# EAGLE design bucket (EAGLE 7.2.0)
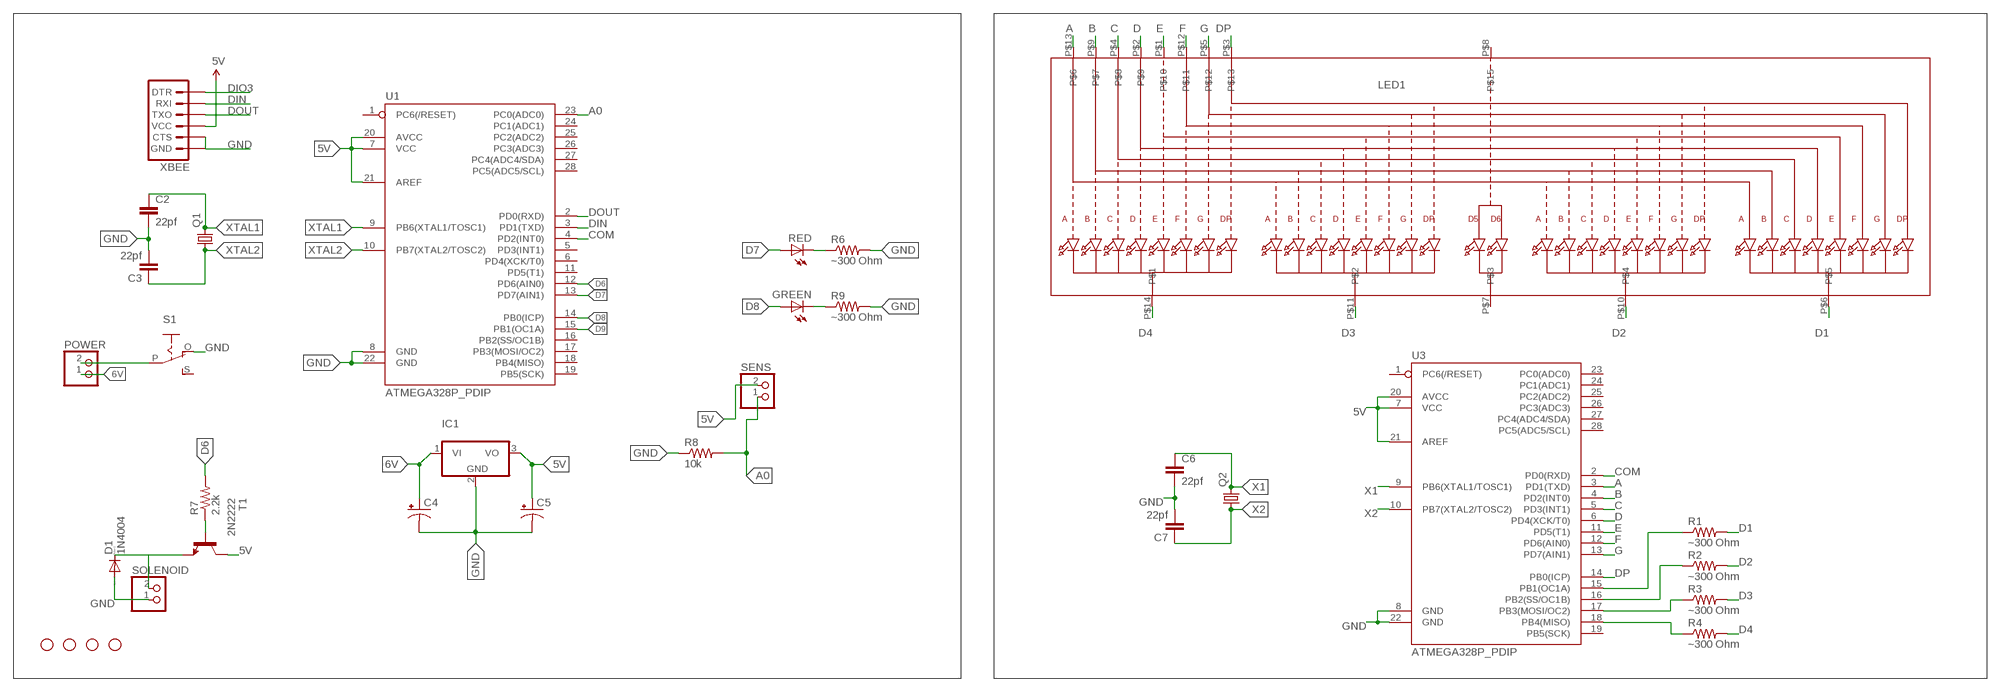
[diagram p0: schematic, sheet 1]

## Parts
C2  22pf  CAP1206  [1206]
C3  22pf  CAP1206  [1206]
C4  CAP_POL1206  [EIA3216]
C5  CAP_POL1206  [EIA3216]
C6  22pf  CAP1206  [1206]
C7  22pf  CAP1206  [1206]
D1  1N4004  [DO41-10]
GREEN  HSMC-C265  [HSMC-C265]
IC1  7805T  [TO220H]
LED1  DISP_SEGMENT_4DIGIT_BL-Q56C43  [SEGMENT-BL-Q56C43]
POWER  JST_2PIN-THM-RA  [JST-PH-2-THM-RA]
Q1  CRYSTALHC49S  [HC49/S]
Q2  CRYSTALHC49S  [HC49/S]
R1  ~300 Ohm  RESISTOR1206  [1206]
R2  ~300 Ohm  RESISTOR1206  [1206]
R3  ~300 Ohm  RESISTOR1206  [1206]
R4  ~300 Ohm  RESISTOR1206  [1206]
R6  ~300 Ohm  RESISTOR1206  [1206]
R7  2.2k  RESISTOR1206  [1206]
R8  10k  RESISTOR1206  [1206]
R9  ~300 Ohm  RESISTOR1206  [1206]
RED  HSMC-C265  [HSMC-C265]
S1  EG1218S  [EG1218]
SENS  JST_2PIN-THM-RA  [JST-PH-2-THM-RA]
SOLENOID  JST_2PIN-THM-RA  [JST-PH-2-THM-RA]
STANDOFF1  STAND-OFF  [STAND-OFF]
STANDOFF2  STAND-OFF  [STAND-OFF]
STANDOFF3  STAND-OFF  [STAND-OFF]
STANDOFF4  STAND-OFF  [STAND-OFF]
T1  2N2222  [TO92-EBC-OVAL]
U1  ATMEGA328P_PDIP  [DIL28-3]
U3  ATMEGA328P_PDIP  [DIL28-3]
XBEE  ARDUINO_SERIAL_PROGRAMPTH  [1X06]

## Nets
1: R1.1 U3.15(PB1(OC1A))
2: R2.1 U3.16(PB2(SS/OC1B))
3: R3.1 U3.17(PB3(MOSI/OC2))
4: R4.1 U3.18(PB4(MISO))
5V: C5.A(+) IC1.3(VO) SENS.2 T1.E(C) U1.7(VCC) U1.20(AVCC) U1.21(AREF) U3.7(VCC) U3.20(AVCC) U3.21(AREF) XBEE.4(VCC)
6V: C4.A(+) IC1.1(VI) POWER.1
A: LED1.P$13 U3.3(PD1(TXD))
A0: R8.2 SENS.1 U1.23(PC0(ADC0))
B: LED1.P$9 U3.4(PD2(INT0))
C: LED1.P$4 U3.5(PD3(INT1))
COM: U1.4(PD2(INT0)) U3.2(PD0(RXD))
D: LED1.P$2 U3.6(PD4(XCK/T0))
D1: LED1.P$6 R1.2
D2: LED1.P$10 R2.2
D3: LED1.P$11 R3.2
D4: LED1.P$14 R4.2
D6: R7.2 U1.12(PD6(AIN0))
D7: RED.A U1.13(PD7(AIN1))
D8: GREEN.A U1.14(PB0(ICP))
D9: U1.15(PB1(OC1A))
DIN: U1.3(PD1(TXD)) XBEE.2(RXI)
DIO3: XBEE.1(DTR)
DOUT: U1.2(PD0(RXD)) XBEE.3(TXO)
DP: LED1.P$3 U3.14(PB0(ICP))
E: LED1.P$1 U3.11(PD5(T1))
F: LED1.P$12 U3.12(PD6(AIN0))
G: LED1.P$5 U3.13(PD7(AIN1))
GND: C2.2 C3.2 C4.C(-) C5.C(-) C6.2 C7.2 D1.A IC1.2(GND) R6.2 R8.1 R9.2 S1.O SOLENOID.1 U1.8(GND) U1.22(GND) U3.8(GND) U3.22(GND) XBEE.5(CTS) XBEE.6(GND)
N$1: POWER.2 S1.P
N$2: D1.C SOLENOID.2 T1.C(E)
N$8: R6.1 RED.C
N$9: R7.1 T1.B
N$15: GREEN.C R9.1
X1: C6.1 Q2.2 U3.9(PB6(XTAL1/TOSC1))
X2: C7.1 Q2.1 U3.10(PB7(XTAL2/TOSC2))
XTAL1: C2.1 Q1.2 U1.9(PB6(XTAL1/TOSC1))
XTAL2: C3.1 Q1.1 U1.10(PB7(XTAL2/TOSC2))
Unconnected: LED1.P$7 LED1.P$8 S1.S U1.1(PC6(/RESET)) U1.5(PD3(INT1)) U1.6(PD4(XCK/T0)) U1.11(PD5(T1)) U1.16(PB2(SS/OC1B)) U1.17(PB3(MOSI/OC2)) U1.18(PB4(MISO)) U1.19(PB5(SCK)) U1.24(PC1(ADC1)) U1.25(PC2(ADC2)) U1.26(PC3(ADC3)) U1.27(PC4(ADC4/SDA)) U1.28(PC5(ADC5/SCL)) U3.1(PC6(/RESET)) U3.19(PB5(SCK)) U3.23(PC0(ADC0)) U3.24(PC1(ADC1)) U3.25(PC2(ADC2)) U3.26(PC3(ADC3)) U3.27(PC4(ADC4/SDA)) U3.28(PC5(ADC5/SCL))

## Library data of the parts
C2 C3 C6 C7 = SparkFun-Passives:CAP: Capacitor Standard 0603 ceramic capacitor, and 0.1" leaded capacitor.
C4 C5 = SparkFun-Passives:CAP_POL: Capacitor Polarized These are standard SMD and PTH capacitors. Normally 10uF, 47uF, and 100uF in electrolytic and tantalum varieties. Always verify the external diameter of the through hole cap, it varies with capacity, voltage, and manufacturer. The EIA devices should be standard.
D1 = diode:1N4004: DIODE general purpose rectifier, 1 A
GREEN RED = SparkFun-Retired:HSMC-C265: RETIRED Avago HSMC-C265 reverse-mounted red LED This is a SMD LED that is mounted to one side of a PCB and shines through a hole to the other side of the PCB. Useful for making boards with no components on one side for mounting and having LED indicator lights shine through the board, panel, etc.
IC1 = adafruit:78*: Positive VOLTAGE REGULATOR Added bigger pads to the TO-92 package
LED1 = microbuilder:DISP_SEGMENT_4DIGIT_BL-Q56C43
POWER SENS SOLENOID = adafruit:JST_2PIN: JST 2-Pin Connectors of various flavors SMT-RA (S2B-PH-SM4) 4UConnector #17311 SMT (B2B-PH-SM4) THM-RA (S2B-PH) THM (B2B-PH)
Q1 Q2 = adafruit:CRYSTAL: CRYSTAL; OC_FARNELL: 1667008; OC_NEWARK: unknown
R1-R4 R6-R9 = SparkFun-Passives:RESISTOR: Resistor Basic schematic elements and footprints for 0603, 1206, and PTH resistors.
S1 = adafruit:EG1218: SLIDING SWITCH 0.1" spacing through hole, vertical SPDT slide switch http://www.ladyada.net/library/pcb/eaglelibrary.html
STANDOFF1-STANDOFF4 = SparkFun-Electromechanical:STAND-OFF: #4 Stand Off This is the mechanical footprint for a #4 phillips button head screw. Use the keepout ring to avoid running the screw head into surrounding components. SKU : PRT-00447
T1 = adafruit:2N2222: NPN TRANSISTOR Big oval pads
U1 U3 = SparkFun-DigitalIC:ATMEGA328P_PDIP: uC used in the Arduino 32kb flash, 1k EEPROM, 2k SRAM This is the through-hole version of this chip.
XBEE = SparkFun:ARDUINO_SERIAL_PROGRAM

## Net classes
0 default: width 0.203 mm
2 gnd: width 0.305 mm, drill 0.711 mm, clearance 0.203 mm

## Board
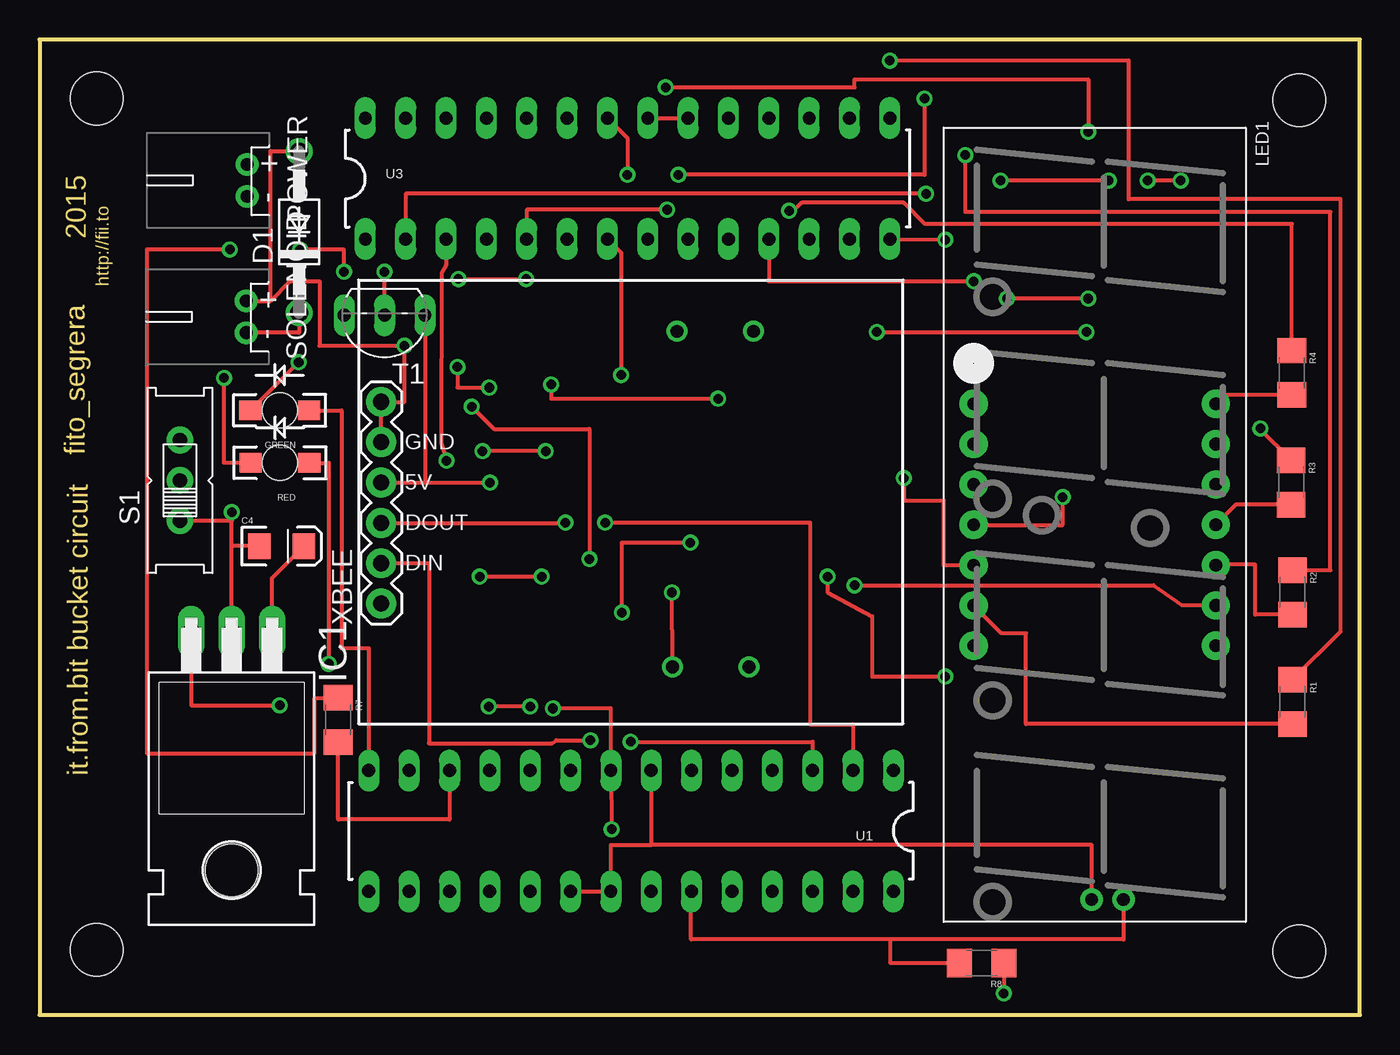
[diagram p1: board, top side]
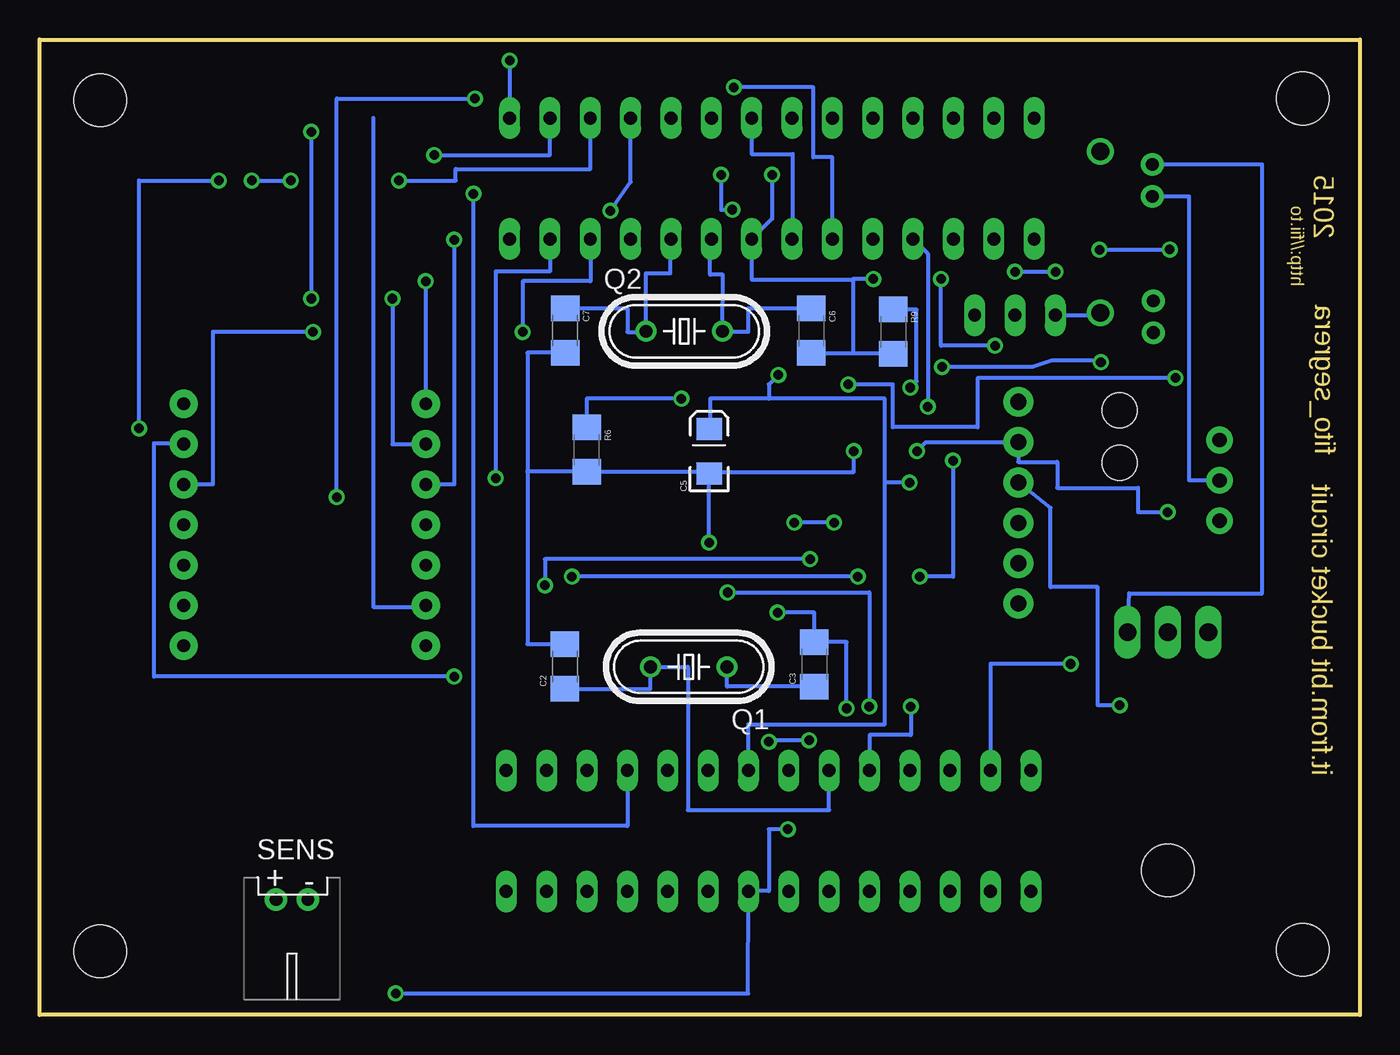
[diagram p2: board, bottom side, seen from below]

Size 83.1 x 61.4 mm. Coordinates in mm from the lower left corner, seen from the top.
Outline: 0,0 83.1,0 83.1,61.4 0,61.4 0,0
Copper layers (1*16): Top 0.035mm / dielectric 1.5mm / Bottom 0.035mm
Design rules "default": minimum track width 8mil, minimum drill 15mil, track to track 8mil, track to pad 8mil, pad to pad 8mil, via to via 8mil, smd to smd 8mil, copper to edge 1mil, drill to drill 8mil, minimum pad ring 10mil, minimum via ring 8mil, stop-mask expansion 4mil, vias tented up to drill 20mil, thermal gap 10mil

### Footprints (pad centres in the part's own frame; a part is rotated, then mirrored left to right if it is on the bottom)
1206 = smd 1.6 x 1.8: 1 -1.4,0; 2 1.4,0
EIA3216 = smd 1.4 x 1.6: A 1.4,0; C -1.4,0
DO41-10 = drill 1.118: A 5.08,0; C -5.08,0
HSMC-C265 = smd 1.4 x 1.25: A -1.85,0; C 1.85,0 | hole 2.2: 0,0
TO220H = drill 1.118 long: 1 -2.54,-10.16; 2 0,-10.16; 3 2.54,-10.16 | hole 3.302: 0,4.826
SEGMENT-BL-Q56C43 = drill 0.8 pad 1.778: P$1 -7.62,-7.62; P$2 -5.08,-7.62; P$3 -2.54,-7.62; P$4 0,-7.62; P$5 2.54,-7.62; P$6 5.08,-7.62; P$7 7.62,-7.62; P$8 7.62,7.62; P$9 5.08,7.62; P$10 2.54,7.62; P$11 0,7.62; P$12 -2.54,7.62; P$13 -5.08,7.62; P$14 -7.62,7.62
JST-PH-2-THM-RA = drill 0.8 pad 1.422: 1 1,0; 2 -1,0
HC49/S = drill 0.813: 1 -2.413,0; 2 2.413,0
EG1218 = drill 0.9 pad 1.676: O -2.54,0; P 0,0; S 2.54,0
STAND-OFF = hole 3.302: 0,0
TO92-EBC-OVAL = drill 0.813 long: B 0,-1.27; C 2.54,-1.27; E -2.54,-1.27
DIL28-3 = drill 0.813 long: 1 -16.51,-3.81; 2 -13.97,-3.81; 3 -11.43,-3.81; 4 -8.89,-3.81; 5 -6.35,-3.81; 6 -3.81,-3.81; 7 -1.27,-3.81; 8 1.27,-3.81; 9 3.81,-3.81; 10 6.35,-3.81; 11 8.89,-3.81; 12 11.43,-3.81; 13 13.97,-3.81; 14 16.51,-3.81; 15 16.51,3.81; 16 13.97,3.81; 17 11.43,3.81; 18 8.89,3.81; 19 6.35,3.81; 20 3.81,3.81; 21 1.27,3.81; 22 -1.27,3.81; 23 -3.81,3.81; 24 -6.35,3.81; 25 -8.89,3.81; 26 -11.43,3.81; 27 -13.97,3.81; 28 -16.51,3.81
1X06 = drill 1.016 pad 1.88: 1 0,0; 2 2.54,0; 3 5.08,0; 4 7.62,0; 5 10.16,0; 6 12.7,0

### Placement (x,y rotation side)
C2  50.03,21.94 90 bottom
C3  34.34,22.08 90 bottom
C4  15.23,29.52 0 top
C5  40.96,35.49 90 bottom
C6  34.52,43.08 270 bottom
C7  50.02,43.1 270 bottom
D1  16.33,49.29 90 top
GREEN  15.11,38.06 180 top
IC1  12.08,13.94 180 top
LED1  66.41,30.86 270 top
POWER  13.06,52.54 90 top
Q1  42.24,21.91 180 bottom
Q2  42.53,43.04 0 bottom
R1  78.86,19.71 270 top
R2  78.86,26.61 270 top
R3  78.78,33.53 270 top
R4  78.82,40.43 270 top
R6  48.66,35.59 270 bottom
R7  18.78,18.59 270 top
R8  59.29,3.27 180 top
R9  29.36,43.01 270 bottom
RED  15.13,34.76 180 top
S1  8.83,33.65 90 top
SENS  67.22,7.26 180 bottom
SOLENOID  13,43.95 90 top
STANDOFF1  3.6,57.7 0 top
STANDOFF2  3.6,4.1 0 top
STANDOFF3  79.3,57.6 0 top
STANDOFF4  79.3,4 0 top
T1  21.71,42.79 180 top
U1  37.22,11.59 180 top
U3  37.01,52.66 0 top
XBEE  21.5,25.9 90 top

### Tracks (layer width: path | path; a pad name or v marks a point on that pad's centre or on a via)
1  (via drill 0.6)
  Top 0.254: R1.1 81.89,24.14 81.89,51.37 68.55,51.35 68.55,60.08 v53.52,60.08
  Bottom 0.254: v53.52,60.08 U3.15
2  (via drill 0.6)
  Top 0.254: R2.1 81.25,28.01 81.25,50.55 58.27,50.55 v58.27,54.14
  Bottom 0.254: v58.27,54.14 50.98,54.14 U3.16
3  (via drill 0.6)
  Top 0.254: R3.1 76.84,36.87 v76.84,36.93 | v71.82,52.54 v69.75,52.54 | v67.29,52.54 v60.49,52.54
  Bottom 0.254: v76.84,36.93 76.84,52.54 v71.82,52.54 | v69.75,52.54 v67.29,52.54 | v60.49,52.54 56.92,52.54 56.92,53.26 48.44,53.26 U3.17
4  (via drill 0.6)
  Top 0.254: R4.1 78.82,49.8 55.74,49.8 54.4,51.14 47.96,51.14 47.45,50.63 v47.18,50.63
  Bottom 0.254: v47.18,50.63 45.9,52.44 U3.18
5V  (via drill 0.6)
  Top 0.254: U1.20 U1.21 35.95,10.7 38.5,10.7 | 38.5,10.7 U1.7 | U3.21 U3.20 | U3.7 36.6,47.98 v36.6,40.3 | XBEE.4 24.27,33.52 | 24.27,33.52 v28.34,33.52 | SENS.2 66.22,10.7 38.5,10.7 | T1.E 24.27,33.52 | IC1.3 9.54,19.49 v15.11,19.49
  Bottom 0.254: U1.7 38.49,18.3 29.9,18.3 29.9,33.52 | 29.9,33.52 29.9,38.8 37.2,38.8 | 37.2,38.8 40.9,38.8 40.9,36.89 C5.A | U3.21 38.28,54.2 35.7,54.2 35.7,48.85 U3.7 | v36.6,40.3 37.2,39.7 37.2,38.8 | v28.34,33.52 29.9,33.52 | v15.11,19.49 16.5,19.49 16.5,26.93 19.47,26.93 19.47,31.92 XBEE.4
6V
  Top 0.254: IC1.1 14.62,27.5 C4.A
  Bottom 0.254: IC1.1 14.52,26.54 6.14,26.54 6.14,53.54 POWER.1
A  (via drill 0.6)
  Top 0.254: U3.3 25.58,47.18 25.3,46.7 25.28,36.02 v25.6,34.9 | v27.7,27.6 v31.6,27.6 | v49.6,27.6 49.6,26.6 52.4,25.1 52.4,21.3 v57,21.3
  Bottom 0.254: v25.6,34.9 25.6,27.6 v27.7,27.6 | v31.6,27.6 v49.6,27.6 | v57,21.3 75.9,21.3 75.9,36 74.03,36 LED1.P$13
A0
  Top 0.254: SENS.1 68.22,4.75 53.56,4.75 | 53.56,4.75 41.01,4.75 41.01,7.78 U1.23 | R8.2 53.56,3.27 53.56,4.75
B  (via drill 0.6)
  Top 0.254: v27.2,38.3 28.6,36.9 34.6,36.9 v34.6,28.7 | v51.3,27.05 70.13,27.05 71.9,25.8 74.01,25.8 LED1.P$9
  Bottom 0.254: U3.4 27.2,47.93 v27.2,38.3 | v34.6,28.7 51.3,28.7 v51.3,27.05
C  (via drill 0.6)
  Top 0.254: LED1.P$4 64.4,30.86 v64.4,32.6 | v55.7,57.7 55.7,52.9 v40.2,52.9 | v39.5,50.7 30.66,50.7 U3.5
  Bottom 0.254: v64.4,32.6 64.4,57.7 v55.7,57.7 | v40.2,52.9 40.2,50.7 v39.5,50.7
COM  (via drill 0.6)
  Top 0.254: v55.8,51.7 23.04,51.7 U3.2
  Bottom 0.254: U1.4 46.11,11.9 55.8,11.9 v55.8,51.7
D  (via drill 0.6)
  Top 0.254: v39.4,58.4 51.3,58.4 51.3,58.9 66,58.9 v66,55.6 | v66,45.1 v60.9,45.1
  Bottom 0.254: U3.6 33.2,54 34.4,54 34.4,58.4 v39.4,58.4 | v66,55.6 v66,45.1 | v60.9,45.1 60.9,35.94 LED1.P$2
D1
  Top 0.254: R1.2 62.09,18.31 62.09,24.03 60.54,24.03 LED1.P$6
  Bottom 0.254: 62.1,56.47 62.1,25.7 58.79,25.7 LED1.P$6
D2
  Top 0.254: R2.2 76.52,25.21 76.52,28.35 74.03,28.35 LED1.P$10
D3
  Top 0.254: R3.2 75.3,32.13 LED1.P$11
D4
  Top 0.254: R4.2 74.58,39.03 LED1.P$14
D6
  Top 0.254: U1.12 25.79,12.3 18.8,12.3 18.8,17.19 R7.2
D7  (via drill 0.6)
  Top 0.254: RED.A 18.2,34.76 v18.2,22.1
  Bottom 0.254: v18.2,22.1 23.25,22.1 U1.13
D8
  Top 0.254: GREEN.A 19,38.06 19,23.1 20.71,23.1 U1.14
DIN  (via drill 0.6)
  Top 0.254: XBEE.2 24.5,28.44 24.5,17.11 32.26,17.11 32.52,17.3 v34.67,17.3 | v37.2,17.2 48.65,17.2 U1.3
  Bottom 0.254: v34.67,17.3 37.01,17.3 v37.2,17.2
DOUT  (via drill 0.6)
  Top 0.254: XBEE.3 33.1,30.98 v33.1,31 | v35.6,31 48.5,31 48.5,18.3 51.19,18.3 U1.2
  Bottom 0.254: v33.1,31 v35.6,31
DP  (via drill 0.6)
  Top 0.254: U3.14 v57,48.8
  Bottom 0.254: v57,48.8 57,33.4 LED1.P$3
E  (via drill 0.6)
  Top 0.254: U3.11 45.9,46.2 v58.8,46.2
  Bottom 0.254: v58.8,46.2 LED1.P$1
F  (via drill 0.6)
  Top 0.254: v52.7,43 v65.9,43
  Bottom 0.254: U3.12 48.44,46.2 52.7,46.2 v52.7,43 | v65.9,43 72.2,43 72.2,33.4 LED1.P$12
G  (via drill 0.6)
  Top 0.254: v54.4,33.8 54.4,32.4 56.9,32.4 56.9,28.32 LED1.P$5
  Bottom 0.254: U3.13 50.98,46.8 54.4,46.8 v54.4,33.8
GND  (via drill 0.6)
  Top 0.254: v36,11.7 U1.8 35.95,19.3 v32.3,19.3 | U3.22 37,55.2 v37,52.9 | XBEE.5 XBEE.6 22.96,38.6 v22.96,42.14 17.61,42.13 17.61,46.19 15.78,46.2 14.53,44.95 | v26.36,46.34 v30.62,46.34 | IC1.2 12.09,29.51 | 12.09,29.51 12.09,31.11 | 12.09,31.11 S1.O | v12.09,31.66 12.09,31.11 | R8.1 v60.69,1.35 | C4.C 12.16,29.52 12.09,29.51 | v36.65,25.33 36.65,29.74 v40.96,29.74 | v31.85,35.5 v27.87,35.5 | SOLENOID.1 14.53,44.95 | 14.53,44.95 14.53,54.39 16.33,54.39 D1.A
  Bottom 0.254: v36,11.7 37.2,11.7 37.2,7.8 38.49,7.8 U1.22 38.5,1.35 v60.69,1.35 | v32.3,19.3 32.3,23.48 C3.2 34.34,25.33 v36.65,25.33 | C7.2 52.4,41.7 52.4,34.2 52.39,34.2 | C6.2 31.9,41.68 | 31.9,41.68 29.36,41.68 R9.2 | v37,52.9 37,50.12 U3.8 38.28,46.3 31.9,46.3 | 31.9,46.3 31.9,41.68 | v22.96,42.14 26.36,42.14 v26.36,46.34 | v30.62,46.34 31.9,46.34 31.9,46.3 | v12.09,31.66 13.96,31.66 13.96,33.18 19.04,33.18 19.04,34.82 21.5,34.82 XBEE.5 27.31,36.06 v27.87,35.5 | v40.96,29.74 C5.C 40.96,34.19 | 40.96,34.19 R6.2 52.39,34.2 | 52.39,34.2 52.39,23.35 C2.2 | 40.96,34.19 31.85,34.19 v31.85,35.5
N$1
  Bottom 0.254: S1.P 10.74,33.65 10.74,51.52 13.06,51.52 POWER.2
N$2
  Top 0.254: D1.C 16.33,42.95 SOLENOID.2
  Bottom 0.254: T1.C 16.48,44.06 arc-90 D1.C
N$8  (via drill 0.6)
  Top 0.254: RED.C 11.6,34.76 v11.6,40.1 | v32.2,39.7 32.2,38.8 v42.7,38.8
  Bottom 0.254: v11.6,40.1 20.2,40.1 24.07,40.09 24.07,37 29.4,37 29.4,39.7 v32.2,39.7 | v42.7,38.8 48.66,38.8 R6.1
N$9  (via drill 0.6)
  Top 0.254: T1.B v21.71,46.79 | v19.15,46.79 19.15,48.17 v16.39,48.17 | v11.97,48.19 6.75,48.19 6.75,16.48 17.3,16.48 17.3,19.96 18.78,19.96 R7.1
  Bottom 0.254: v21.71,46.79 v19.15,46.79 | v16.39,48.17 16.39,48.19 v11.97,48.19
N$15  (via drill 0.6)
  Top 0.254: GREEN.C v16.3,41.1 | v26.3,40.8 26.3,39.5 v28.3,39.5
  Bottom 0.254: v16.3,41.1 16.4,41.2 19.38,41.2 20.6,40.8 v26.3,40.8 | v28.3,39.5 27.9,39.9 27.9,44.4 27.91,44.41 R9.1
X1
  Bottom 0.254: U3.9 40.9,48.85 40.9,46.6 40.09,46.6 Q2.2 40.11,43 38.5,43 38.5,44.48 C6.1
X2
  Bottom 0.254: U3.10 43.4,48.85 43.4,46.7 44.94,46.7 Q2.1 44.94,43 46.1,43 46.1,44.5 C7.1
XTAL1
  Bottom 0.254: C2.1 44.65,20.54 Q1.2 42.3,21.91 42.3,12.9 33.41,12.9 U1.9
XTAL2  (via drill 0.6)
  Top 0.254: Q1.1 v39.8,26.6 | v30.87,19.41 v28.27,19.42
  Bottom 0.254: C3.1 39.83,20.68 Q1.1 | v39.8,26.6 30.87,26.6 v30.87,19.41 | v28.27,19.42 28.27,17.63 30.86,17.63 U1.10

### Text on the board
Dimension: 2015 | http://fii.to | fito_segrera | it.from.bit bucket circuit
tPlace: GND | 5V | DOUT | DIN